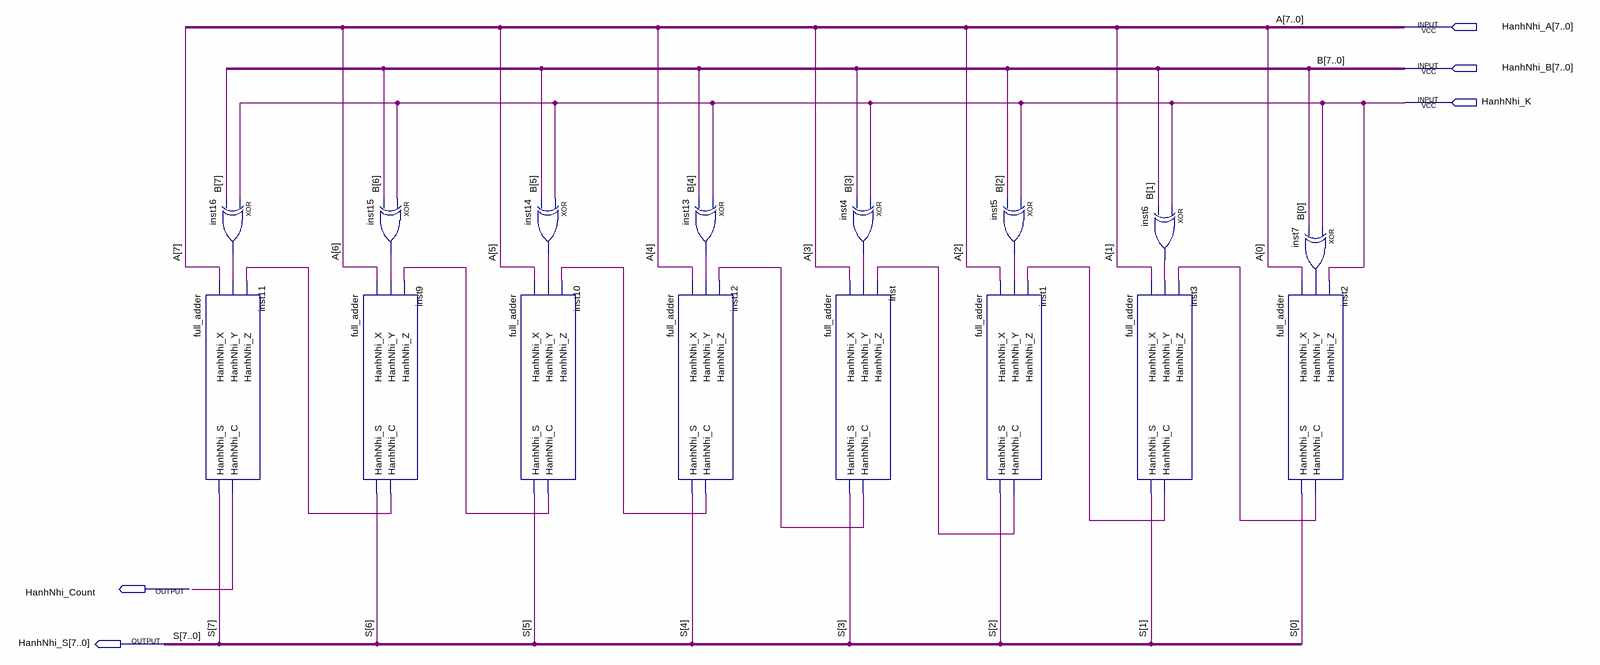
[diagram p0: schematic sheet]
// Quartus schematic adder_subtractor_8.bdf as structural Verilog: 16 symbols, 5 pins
module adder_subtractor_8 (
  input  [7:0] HanhNhi_A,
  input  [7:0] HanhNhi_B,
  input  HanhNhi_K,
  output HanhNhi_Count,
  output [7:0] HanhNhi_S
);

  wire inst1_hanhnhi_c, inst2_hanhnhi_c, inst3_hanhnhi_c, inst4_out, inst5_out, inst6_out, inst7_out,
       inst9_hanhnhi_c, inst10_hanhnhi_c, inst12_hanhnhi_c, inst13_out, inst14_out, inst15_out, inst16_out,
       inst_hanhnhi_c;

  xor inst16 (inst16_out, HanhNhi_K, HanhNhi_B[7]);
  full_adder inst11 (
    .HanhNhi_X(HanhNhi_A[7]), .HanhNhi_Y(inst16_out), .HanhNhi_Z(inst9_hanhnhi_c), .HanhNhi_S(HanhNhi_S[7]),
    .HanhNhi_C(HanhNhi_Count));
  xor inst15 (inst15_out, HanhNhi_K, HanhNhi_B[6]);
  full_adder inst9 (
    .HanhNhi_X(HanhNhi_A[6]), .HanhNhi_Y(inst15_out), .HanhNhi_Z(inst10_hanhnhi_c), .HanhNhi_S(HanhNhi_S[6]),
    .HanhNhi_C(inst9_hanhnhi_c));
  xor inst14 (inst14_out, HanhNhi_K, HanhNhi_B[5]);
  full_adder inst10 (
    .HanhNhi_X(HanhNhi_A[5]), .HanhNhi_Y(inst14_out), .HanhNhi_Z(inst12_hanhnhi_c), .HanhNhi_S(HanhNhi_S[5]),
    .HanhNhi_C(inst10_hanhnhi_c));
  full_adder inst12 (
    .HanhNhi_X(HanhNhi_A[4]), .HanhNhi_Y(inst13_out), .HanhNhi_Z(inst_hanhnhi_c), .HanhNhi_S(HanhNhi_S[4]),
    .HanhNhi_C(inst12_hanhnhi_c));
  xor inst13 (inst13_out, HanhNhi_K, HanhNhi_B[4]);
  full_adder inst (
    .HanhNhi_X(HanhNhi_A[3]), .HanhNhi_Y(inst4_out), .HanhNhi_Z(inst1_hanhnhi_c), .HanhNhi_S(HanhNhi_S[3]),
    .HanhNhi_C(inst_hanhnhi_c));
  xor inst4 (inst4_out, HanhNhi_K, HanhNhi_B[3]);
  xor inst5 (inst5_out, HanhNhi_K, HanhNhi_B[2]);
  full_adder inst1 (
    .HanhNhi_X(HanhNhi_A[2]), .HanhNhi_Y(inst5_out), .HanhNhi_Z(inst3_hanhnhi_c), .HanhNhi_S(HanhNhi_S[2]),
    .HanhNhi_C(inst1_hanhnhi_c));
  xor inst6 (inst6_out, HanhNhi_K, HanhNhi_B[1]);
  full_adder inst3 (
    .HanhNhi_X(HanhNhi_A[1]), .HanhNhi_Y(inst6_out), .HanhNhi_Z(inst2_hanhnhi_c), .HanhNhi_S(HanhNhi_S[1]),
    .HanhNhi_C(inst3_hanhnhi_c));
  xor inst7 (inst7_out, HanhNhi_K, HanhNhi_B[0]);
  full_adder inst2 (
    .HanhNhi_X(HanhNhi_A[0]), .HanhNhi_Y(inst7_out), .HanhNhi_Z(HanhNhi_K), .HanhNhi_S(HanhNhi_S[0]),
    .HanhNhi_C(inst2_hanhnhi_c));

  // Other names for the same wires on the sheet: A[7:0] = HanhNhi_A; B[7:0] = HanhNhi_B; S[7:0] = HanhNhi_S
endmodule
